# EasyEDA Pro project 光磁共振实验仪.eprj, board FD-OPMR-A2
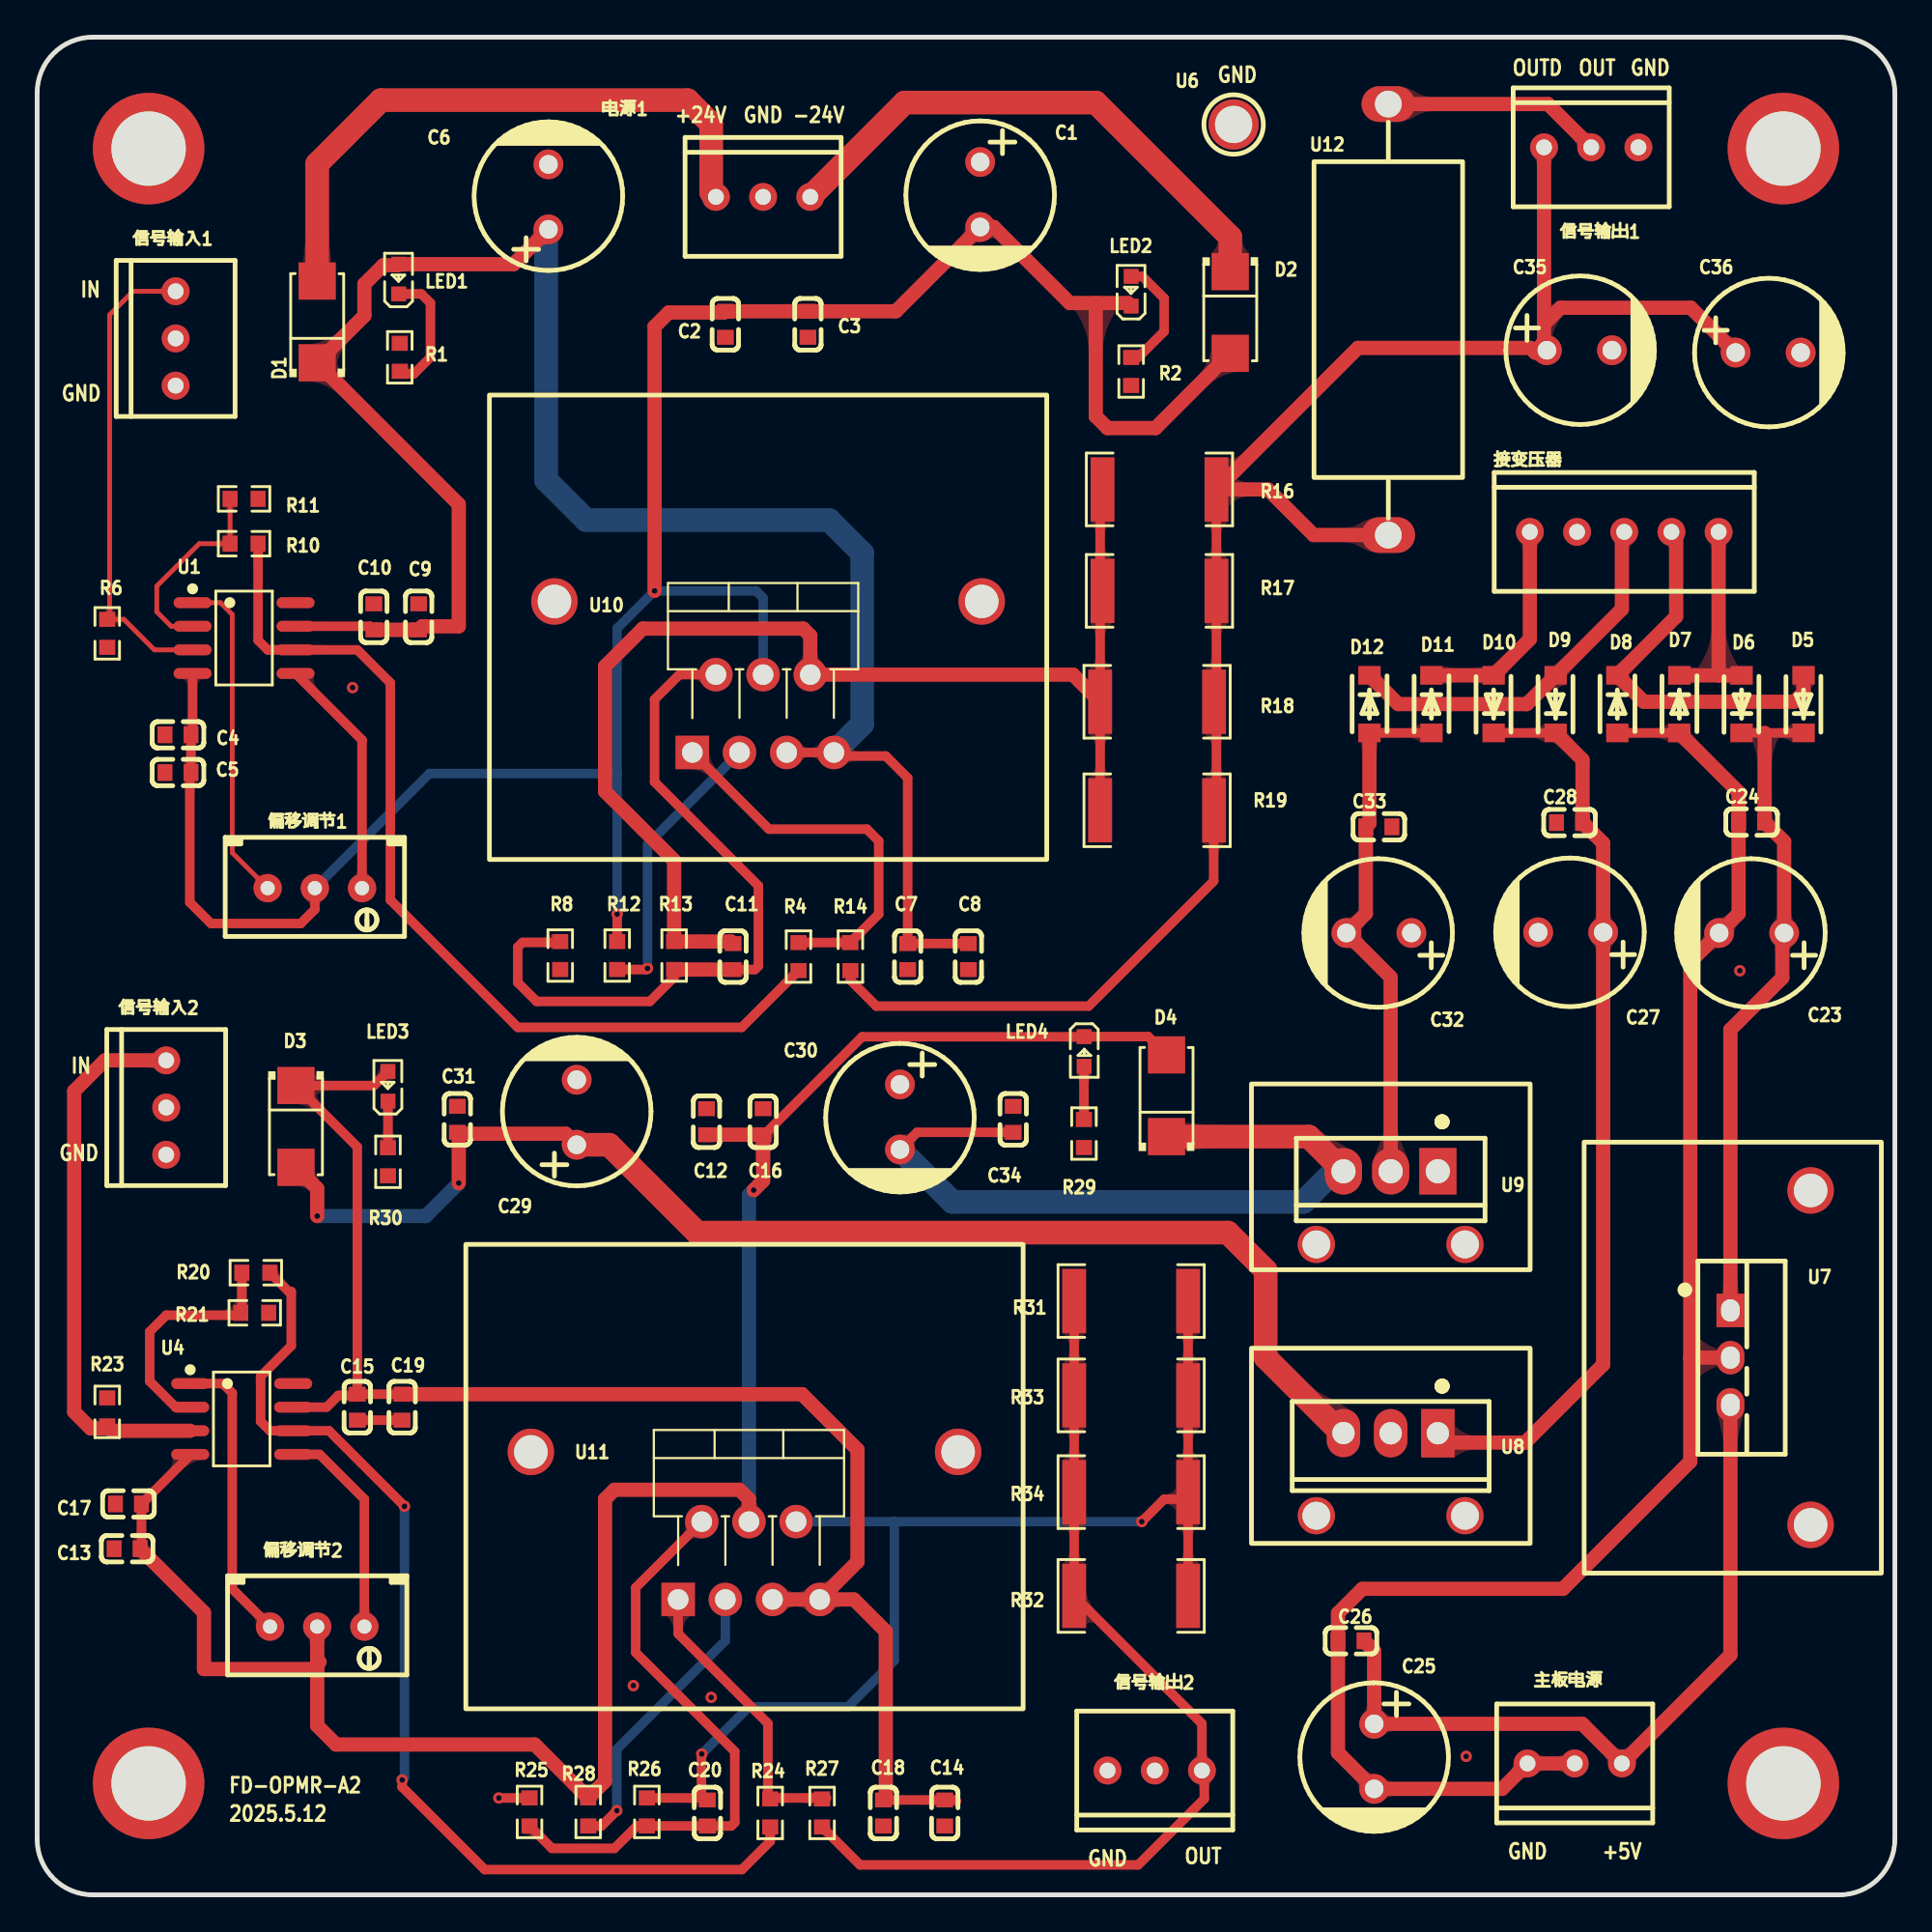
[diagram p11: board, top side]
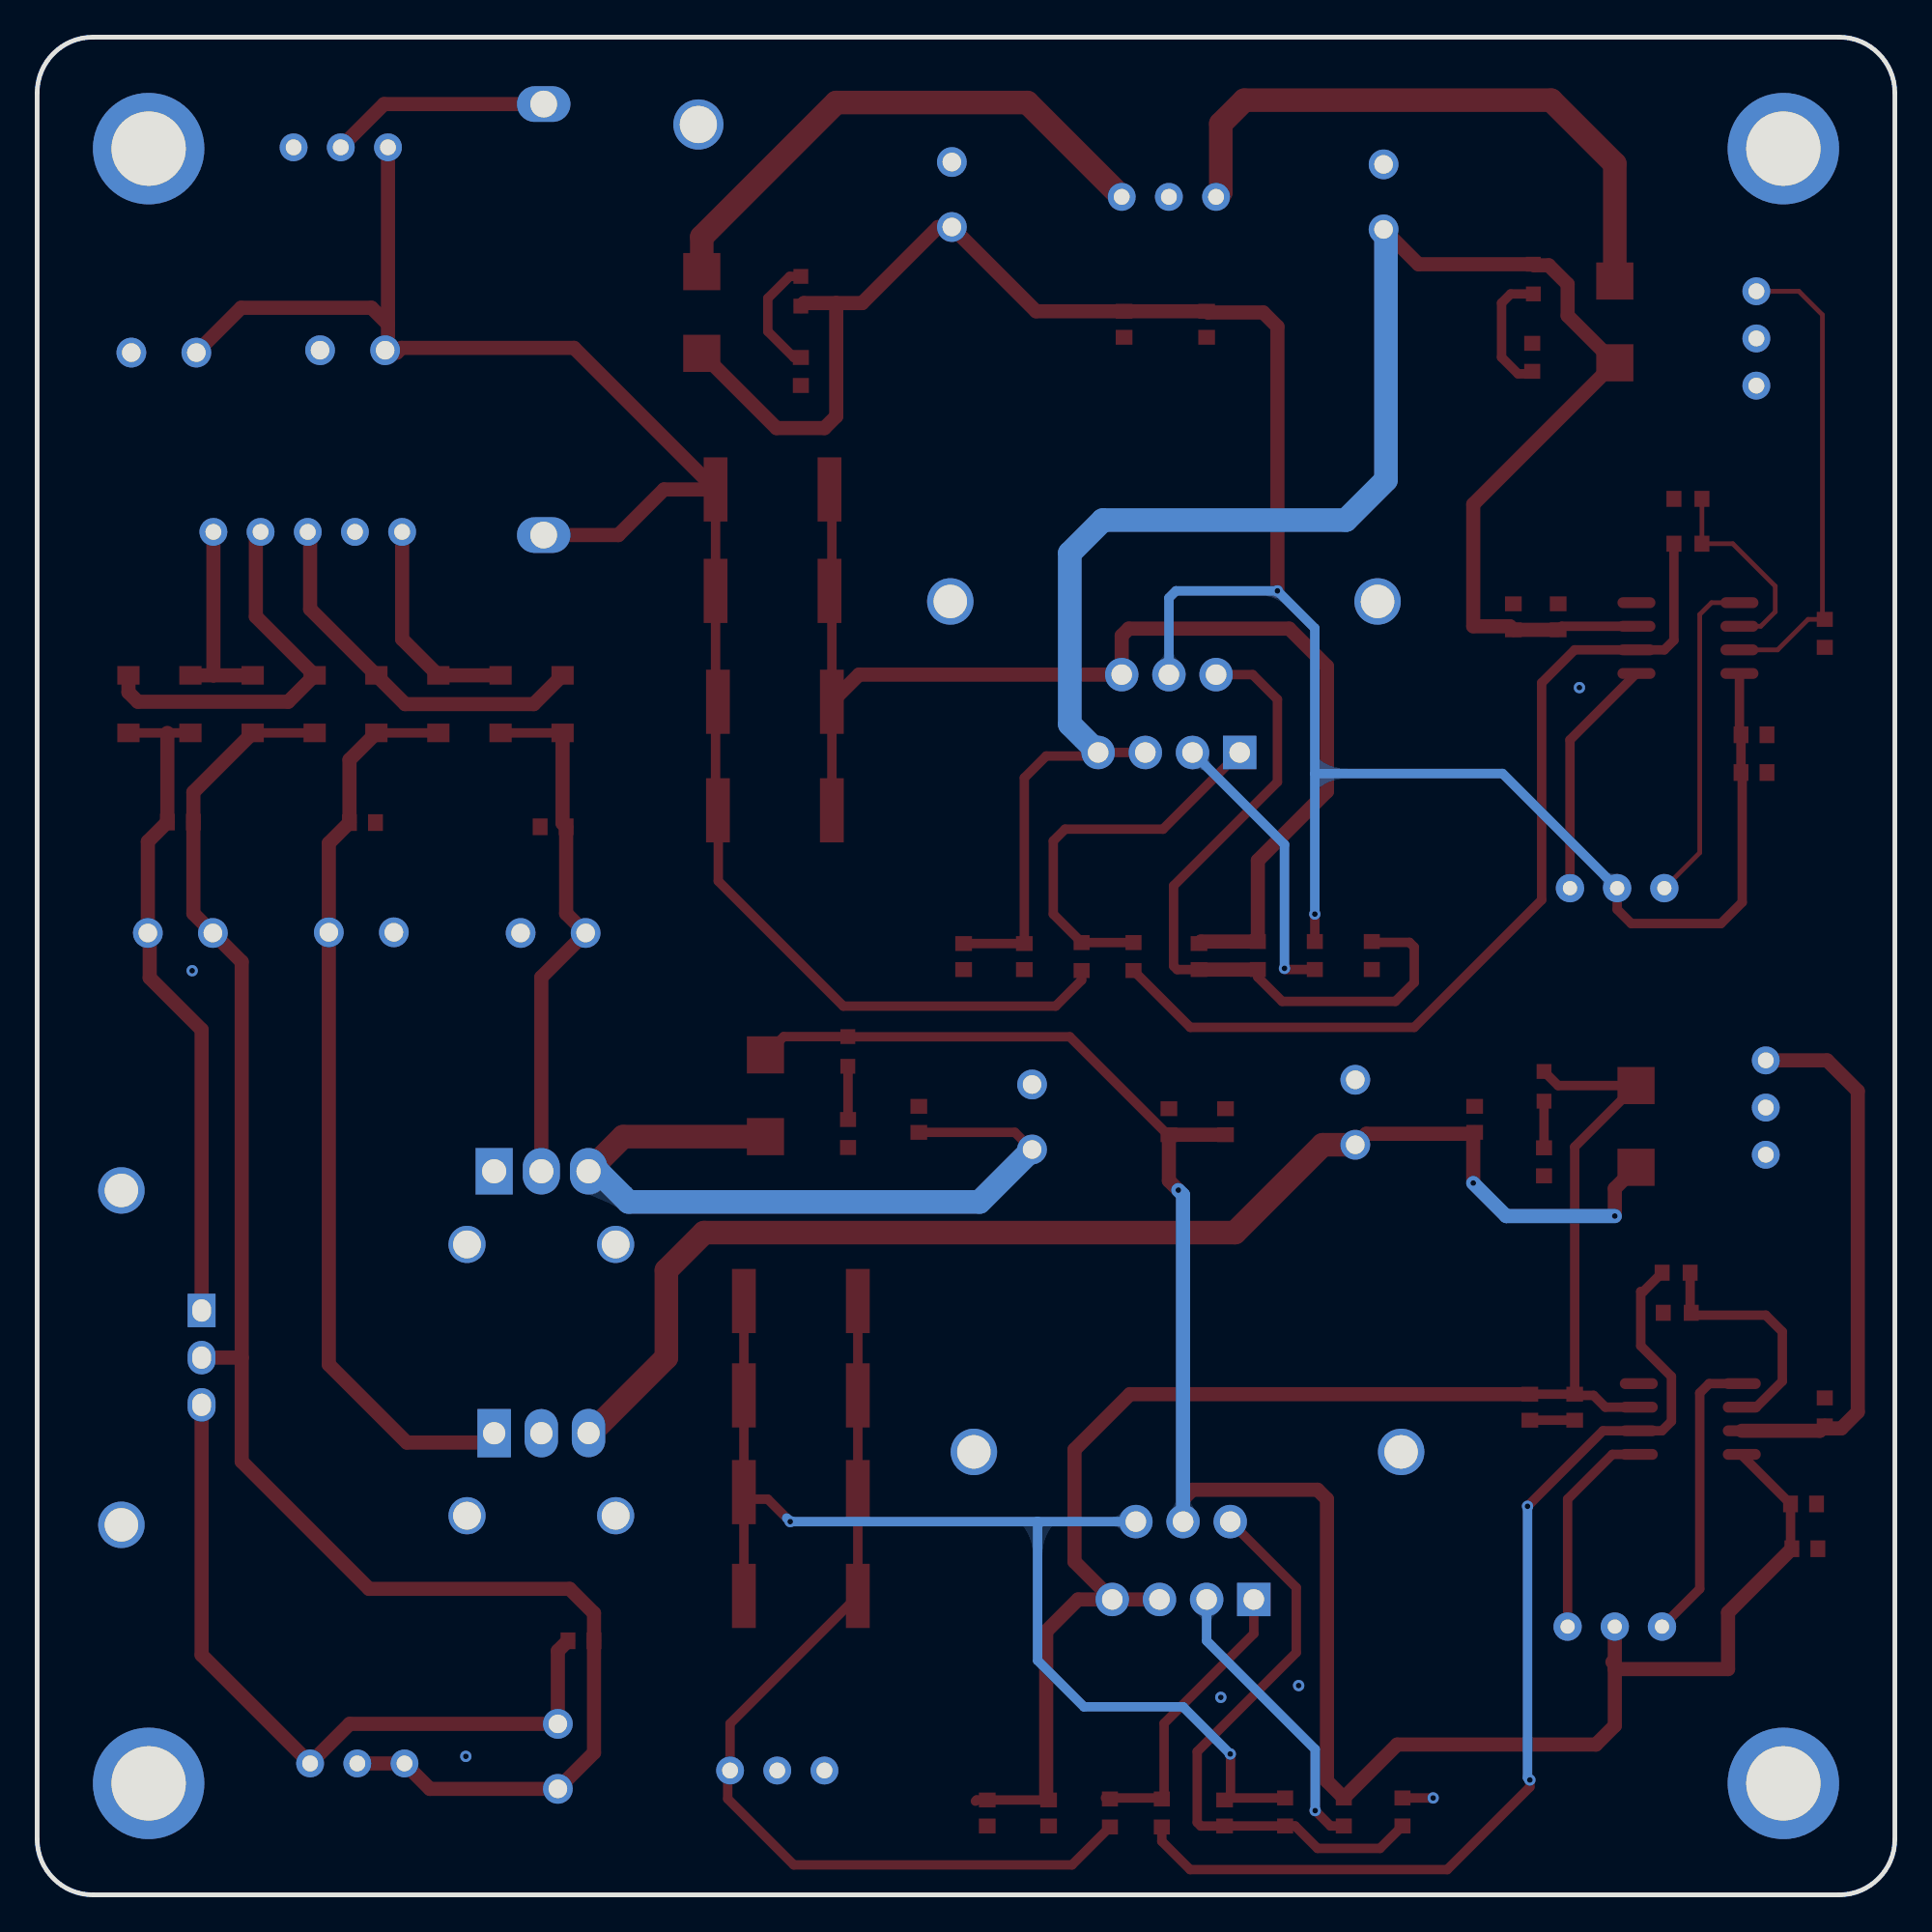
[diagram p12: board, bottom side, seen from below]

Outline 100 x 100 mm; copper layers: Top Layer, Bottom Layer. Coordinates in mm from the lower left corner of the outline.
Outline path: 0,97 0,3 arc(0.88,0.88) 3,0 97,0 arc(99.12,0.88) 100,3 100,97 arc(99.12,99.12) 97,100 3,100 arc(0.88,99.12) 0,97
Stack: Top Layer 0.035mm / Dielectric1 1.51mm FR4 er 4.5 / Bottom Layer 0.035mm

## Design rules (mm)
template: 自定义配置
spacing copperThickness1oz (default): track to track 0.102, other pairs 0.152 to 0.3
spacing copperThickness2oz: track to track 0.203, other pairs 0.152 to 0.3
track width copperThickness1oz (default): min 0.127, default 0.254, max 2.54
track width copperThickness2oz: min 0.203, default 0.254, max 2.54
differential pair differentialPair (default): width min 0.127, default 0.254, max 2.54; gap min 0.152, default 0.152
via viaSize (default): diameter min 0.5, default 0.61, max 10; hole min 0.3, default 0.305, max 6.3

## Placement (name value [footprint] x y rotation side)
C1  470uF  [cap-th_bd8.0-p3.50-d0.6-fd_1]  50.76 91.53 270 top
C2  100nF  [C0603]  37.05 84.54 90 top
C3  10uF  [C0603]  41.49 84.54 90 top
C4  100nF  [C0603]  7.58 62.45 0 top
C5  10uF  [C0603]  7.58 60.41 0 top
C6  470uF  [cap-th_bd8.0-p3.50-d0.6-fd_1]  27.52 91.4 90 top
C7  100nF  [C0603]  46.86 50.51 270 top
C8  10uF  [C0603]  50.13 50.51 270 top
C9  100nF  [C0603]  20.54 68.8 90 top
C10  10uF  [C0603]  18.12 68.8 90 top
C11  5pF  [C0603]  37.46 50.51 90 top
C12  100nF  [C0603]  36.03 41.62 270 top
C13  100nF  [C0603]  4.84 18.63 0 top
C14  100nF  [C0603]  48.86 4.41 270 top
C15  100nF  [C0603]  17.23 26.25 270 top
C16  10uF  [C0603]  39.08 41.62 270 top
C17  10uF  [C0603]  4.92 21.04 0 top
C18  10uF  [C0603]  45.56 4.41 270 top
C19  10uF  [C0603]  19.65 26.25 270 top
C20  5pF  [C0603]  36.08 4.41 90 top
C23  470uF  [cap-th_bd8.0-p3.50-d0.6-fd_1]  92.29 51.78 180 top
C24  100nF  [C0603]  92.29 57.75 0 top
C25  470uF  [cap-th_bd8.0-p3.50-d0.6-fd_1]  71.97 7.46 270 top
C26  100nF  [C0603]  70.72 13.68 0 top
C27  470uF  [cap-th_bd8.0-p3.50-d0.6-fd_1]  82.55 51.81 180 top
C28  100nF  [C0603]  82.49 57.72 0 top
C29  470uF  [cap-th_bd8.0-p3.50-d0.6-fd_1]  29.04 42.13 90 top
C30  470uF  [cap-th_bd8.0-p3.50-d0.6-fd_1]  46.44 41.87 270 top
C31  100nF  [C0603]  22.62 41.75 270 top
C32  470uF  [cap-th_bd8.0-p3.50-d0.6-fd_1]  72.22 51.78 180 top
C33  100nF  [C0603]  72.22 57.49 0 top
C34  100nF  [C0603]  52.54 41.75 90 top
C35  NC  [CAP-TH_BD8.0-P3.50-D0.6-FD_1]  83.02 83.15 0 top
C36  NC  [CAP-TH_BD8.0-P3.50-D0.6-FD_1]  93.18 83.02 0 top
D1  SS34  [SMA_L4.3-W2.6-LS5.2-RD]  15.08 84.67 90 top
D2  SS34  [SMA_L4.3-W2.6-LS5.2-RD]  64.22 85.18 270 top
D3  SS34  [SMA_L4.3-W2.6-LS5.2-RD]  13.93 41.36 270 top
D4  SS34  [SMA_L4.3-W2.6-LS5.2-RD]  60.79 43.02 90 top
D5  SM4007PL  [SOD-123F_L2.8-W1.8-LS3.7-RD]  95.09 64.1 90 top
D6  SM4007PL  [SOD-123F_L2.8-W1.8-LS3.7-RD]  91.75 64.1 90 top
D7  SM4007PL  [SOD-123F_L2.8-W1.8-LS3.7-RD]  88.4 64.1 270 top
D8  SM4007PL  [SOD-123F_L2.8-W1.8-LS3.7-RD]  85.06 64.1 270 top
D9  SM4007PL  [SOD-123F_L2.8-W1.8-LS3.7-RD]  81.74 64.1 90 top
D10  SM4007PL  [SOD-123F_L2.8-W1.8-LS3.7-RD]  78.4 64.1 90 top
D11  SM4007PL  [SOD-123F_L2.8-W1.8-LS3.7-RD]  75.05 64.1 270 top
D12  SM4007PL  [SOD-123F_L2.8-W1.8-LS3.7-RD]  71.72 64.1 270 top
LED1  KT-0603R  [LED0603-RD]  19.46 86.98 90 top
LED2  KT-0603R  [LED0603-RD]  58.89 86.32 90 top
LED3  KT-0603R  [LED0603-RD]  18.89 43.52 90 top
LED4  KT-0603R  [LED0603-RD]  56.36 45.4 270 top
NOREF  -  [Pad_e544]  76.86 35.01 0 top
NOREF#2  -  [Pad_e542]  68.86 35.01 0 top
NOREF#3  -  [Pad_e44671]  6 94 0 top
NOREF#4  -  [Pad_e44673]  6 6 0 top
NOREF#5  -  [Pad_e554]  76.86 20.41 0 top
NOREF#6  -  [Pad_e550]  95.47 19.92 0 top
NOREF#7  -  [Pad_e537]  50.85 69.62 0 top
NOREF#8  -  [Pad_e44672]  94 94 0 top
NOREF#9  -  [Pad_e549]  95.47 37.92 0 top
NOREF#10  -  [Pad_e44674]  94 6 0 top
NOREF#11  -  [Pad_e552]  49.58 23.84 0 top
NOREF#12  -  [Pad_e536]  27.85 69.62 0 top
NOREF#13  -  [Pad_e551]  26.58 23.84 0 top
NOREF#14  -  [Pad_e553]  68.86 20.41 0 top
R1  5.1kΩ  [R0603]  19.52 82.77 270 top
R2  5.1kΩ  [R0603]  58.89 82 90 top
R4  100kΩ  [R0603]  40.98 50.51 90 top
R6  3.6MΩ  [R0603]  3.77 67.91 90 top
R8  100kΩ  [R0603]  28.16 50.56 90 top
R10  1kΩ  [R0603]  11.14 72.73 0 top
R11  NC  [R0603]  11.14 75.15 180 top
R12  12kΩ  [R0603]  31.22 50.56 90 top
R13  100kΩ  [R0603]  34.29 50.56 90 top
R14  100kΩ  [R0603]  43.78 50.51 270 top
R16  24Ω  [R2512]  60.41 75.65 0 top
R17  24Ω  [R2512]  60.41 70.19 0 top
R18  24Ω  [R2512]  60.29 64.22 0 top
R19  24Ω  [R2512]  60.29 58.38 0 top
R20  1kΩ  [R0603]  11.77 33.49 0 top
R21  NC  [R0603]  11.71 31.33 180 top
R23  3.6MΩ  [R0603]  3.77 26 270 top
R24  100kΩ  [R0603]  39.46 4.41 90 top
R25  100kΩ  [R0603]  26.5 4.46 270 top
R26  100kΩ  [R0603]  32.82 4.46 90 top
R27  100kΩ  [R0603]  42.25 4.41 270 top
R28  12kΩ  [R0603]  29.66 4.46 90 top
R29  5.1kΩ  [R0603]  56.35 40.98 90 top
R30  5.1kΩ  [R0603]  18.89 39.46 90 top
R31  24Ω  [R2512]  58.89 31.97 180 top
R32  24Ω  [R2512]  58.89 16.09 180 top
R33  24Ω  [R2512]  58.89 26.89 180 top
R34  24Ω  [R2512]  58.89 21.68 180 top
U1  OPA445AU/2K5  [SOIC-8_L4.9-W3.9-P1.27-LS6.0-BL]  11.14 67.65 270 top
U4  OPA445AU/2K5  [SOIC-8_L4.9-W3.9-P1.27-LS6.0-BL]  11.01 25.62 270 top
U6  TP-黄色测试点  [TESTPOINT-TH_BD3.2]  64.41 95.3 90 top
U7  7805  [TO-220-3_L10.2-W4.5-P2.54-L-1]  91.15 28.92 270 top
U8  7812  [TO-220-3_L10.0-W4.5-P2.54-L]  72.86 24.85 180 top
U9  L7912ACV  [TO-220-3_L10.0-W4.5-P2.54-T]  72.86 38.95 270 top
U10  OPA547T  [TO-220-7-L10.5-W4.5-P1.27-BL]  39.08 63.59 0 top
U11  OPA547T  [TO-220-7-L10.5-W4.5-P1.27-BL]  38.32 18 0 top
U12  NC  [绕线电阻2W]  72.73 84.8 90 top
主板电源  -  [CH2.54-3插座]  82.77 7.07 180 top
信号输入1  -  [CH2.54-3插座]  7.45 83.78 90 top
信号输入2  -  [CH2.54-3插座]  6.95 42.38 90 top
信号输出1  -  [CH2.54-3插座]  83.66 94.07 0 top
信号输出2  -  [CH2.54-3插座]  60.16 6.69 180 top
偏移调节1  1KΩ  [RES-ADJ-TH_3296W]  14.95 54.19 270 top
偏移调节2  1KΩ  [RES-ADJ-TH_3296W]  15.08 14.44 270 top
接变压器  -  [CH2.54-5插座]  85.43 73.37 0 top
电源1  -  [CH2.54-3插座]  39.08 91.4 0 top

## Footprints (pads in the part's own frame, mm; a bottom-side part is the same pattern mirrored in y, then rotated)
C0603
  rect 0.8x0.9 smd: 1(-0.7,0) 2(0.7,0)
cap-th_bd8.0-p3.50-d0.6-fd_1
  round 1.6 hole 1: 1(-1.75,0) 2(1.75,0)
CAP-TH_BD8.0-P3.50-D0.6-FD_1
  round 1.6 hole 1: 1(-1.75,0) 2(1.75,0)
CH2.54-3插座
  round 1.5 hole 0.85: 1(-2.54,0) 2(0,0) 3(2.54,0)
CH2.54-5插座
  round 1.5 hole 0.85: 1(-5.08,0) 2(-2.54,0) 3(0,0) 4(2.54,0) 5(5.08,0)
LED0603-RD
  rect 0.8x0.8 smd: 1(-0.799,0) 2(0.799,0)
Pad_e536
  round 2.5 hole 1.8: 1(0,0)
Pad_e537
  round 2.5 hole 1.8: 2(0,0)
Pad_e542
  round 2 hole 1.5: 9(0,0)
Pad_e544
  round 2 hole 1.5: 9(0,0)
Pad_e549
  round 2.5 hole 1.8: 9(0,0)
Pad_e550
  round 2.5 hole 1.8: 9(0,0)
Pad_e551
  round 2.5 hole 1.8: 1(0,0)
Pad_e552
  round 2.5 hole 1.8: 2(0,0)
Pad_e553
  round 2 hole 1.5: 9(0,0)
Pad_e554
  round 2 hole 1.5: 9(0,0)
Pad_e44671
  round 6 hole 4: 1(0,0)
Pad_e44672
  round 6 hole 4: 1(0,0)
Pad_e44673
  round 6 hole 4: 1(0,0)
Pad_e44674
  round 6 hole 4: 1(0,0)
R0603
  rect 0.806x0.864 smd: 1(-0.753,0) 2(0.753,0)
R2512
  rect 1.282x3.456 smd: 1(-3.067,0) 2(3.067,0)
RES-ADJ-TH_3296W
  round 1.524 hole 0.762: 1(0,2.54) 2(0,0) 3(0,-2.54)
SMA_L4.3-W2.6-LS5.2-RD
  rect 2x2 smd: 1(-2.2,0) 2(2.2,0)
SOD-123F_L2.8-W1.8-LS3.7-RD
  rect 1x1.2 smd: 1(-1.55,0) 2(1.55,0)
SOIC-8_L4.9-W3.9-P1.27-LS6.0-BL
  oval 0.588x2.045 smd: 1(-1.905,-2.772) 2(-0.635,-2.772) 3(0.635,-2.772) 4(1.905,-2.772) 5(1.905,2.772) 6(0.635,2.772) 7(-0.635,2.772) 8(-1.905,2.772)
TESTPOINT-TH_BD3.2
  round 2.7 hole 2: 1(0,0)
TO-220-3_L10.0-W4.5-P2.54-L
  rect 1.8x2.6 hole 1.2: 1(-2.54,0.005)
  oval 1.8x2.6 hole 1.2: 2(0,0.005) 3(2.54,-0.005)
TO-220-3_L10.0-W4.5-P2.54-T
  rect 2.5x2 hole 1.3: 1(0,2.54)
  oval 2.5x2 hole 1.3: 2(0,0) 3(0,-2.54)
TO-220-3_L10.2-W4.5-P2.54-L-1
  rect 1.8x1.5 hole 1.2x1: 1(-2.54,0)
  oval 1.8x1.5 hole 1.2x1: 2(0,0) 3(2.54,0)
TO-220-7-L10.5-W4.5-P1.27-BL
  rect 1.8x1.8 hole 1.105x1.1: 1(-3.81,-2.095)
  round 1.8 hole 1.105x1.1: 2(-2.54,2.095) 3(-1.27,-2.095) 4(0,2.095) 5(1.27,-2.095) 6(2.54,2.095) 7(3.81,-2.095)
绕线电阻2W
  oval 1.92x2.88 hole 1.44: 1(-11.6,0) 2(11.6,0)

## Nets
As in the schematic, except:
GND: C1.1 C2.1 C3.1 C4.1 C5.1 C6.2 C7.2 C8.2 C9.2 C10.2 C12.1 C13.1 C14.2 C15.2 C16.1 C17.1 C18.2 C19.2 C27.2 C28.1 C29.2 C30.1 C31.1 C32.1 C33.2 C34.2 C35.2 C36.2 NOREF#3.1 NOREF#4.1 NOREF#8.1 NOREF#10.1 R1.1 R2.1 R6.1 R8.1 R11.1 R21.1 R23.1 R25.1 R29.1 R30.1 U6.1 U8.2 U9.1 信号输入1.1 信号输入1.2 信号输入2.1 信号输入2.2 信号输出1.3 信号输出2.2 信号输出2.3 接变压器.2 电源1.2

Pads without a net: NOREF 9; NOREF#2 9; NOREF#5 9; NOREF#6 9; NOREF#7 2; NOREF#9 9; NOREF#11 2; NOREF#12 1; NOREF#13 1; NOREF#14 9; U1 8; U4 8

## Via types
v1: diameter 0.61, hole 0.305, Top Layer to Bottom Layer, 17 vias

## Routing (per net, layer and track width the routed paths; a pad name or vN(x,y) marks a point on that pad's centre or on a via; arc(x,y) is an arc through that point)
+12V: length 84
  Top Layer w0.508: 49.49,5.04 49.43,5.11 C14.1 C18.1 ; C15.1 C19.1 ; C15.1 17.23,40.26 D3.1 18.13,43.56 LED3.2 ; C15.1 17.17,26.89 16.22,26.89 15.58,26.25 U4.7
  Top Layer w0.762: U11.7 U11.5 ; U11.7 43.97,15.9 45.68,14.19 45.68,5.23 C18.1 ; U11.7 44.16,17.93 44.16,23.97 41.17,26.95 C19.1
+12V_IN: length 71.1
  Top Layer w0.762: 22.69,40.97 C31.2 ; 22.69,40.97 28.45,40.97 C29.1 ; 22.69,40.97 v1(22.69,38.32) ; D3.2 15.08,38.02 v1(15.08,36.54)
  Top Layer w1.27: 70.19,24.86 66.13,28.92 66.13,33.62 64.1,35.65 35.52,35.65 30.79,40.38 C29.1
  Bottom Layer w0.762: v1(15.08,36.54) 20.92,36.54 v1(22.69,38.32)
+24V: length 105.5
  Top Layer w0.508: U10.5 U10.7 43.08,61.3 45.68,61.3 46.86,60.13 C7.1 C8.1 ; C10.1 17.93,68.29 U1.7
  Top Layer w0.762: C10.1 C9.1 20.73,68.29 22.69,68.29 22.69,74.85 D1.1 17.61,85.01 17.61,86.7 18.63,87.72 19.4,87.72 LED1.2 25.65,87.78 C6.1
  Bottom Layer w1.27: U10.7 44.41,63.02 44.41,72.22 42.63,74 29.55,74 27.39,76.16 27.39,89.53 C6.1
+24V_IN: length 33.5
  Top Layer w1.27: D1.2 15.08,93.18 18.5,96.61 35.01,96.61 36.28,95.34 36.28,91.66 电源1.1
-12V: length 116.2
  Top Layer w0.508: U4.4 8.24,23.67 C17.2 5.61,18.7 C13.2 ; D4.2 59.81,46.2 LED4.1 56.35,46.19 44.41,46.19 39.14,40.92 C16.2
  Top Layer w0.762: 15.08,12.15 15.08,12.41 ; 15.08,12.15 15.08,9.11 16.09,8.09 26.79,8.09 R28.2 30.57,6.12 30.57,21.3 31.08,21.81 37.81,21.81 38.32,21.3 U11.4 ; 15.08,12.15 8.98,12.15 8.98,15.2 C13.2 ; 15.08,12.41 偏移调节2.2 ; 15.08,12.41 15.2,12.53 ; v1(38.57,37.94) 39.08,38.44 C16.2 C12.2
  Bottom Layer w0.762: v1(38.57,37.94) 38.32,37.68 U11.4
-12V_IN: length 42.5
  Top Layer w0.508: C34.1 47.37,41.05 C30.2
  Top Layer w1.27: U9.3 68.46,40.81 D4.1
  Bottom Layer w1.27: C30.2 49.27,37.3 68.16,37.3 69.81,38.95 U9.3
-24V: length 128.8
  Top Layer w0.508: U1.4 8.37,62.53 C4.2 C5.2 8.22,60.35 8.22,53.43 9.36,52.29 14.19,52.29 14.95,53.05 偏移调节1.2 ; R12.2 v1(31.22,52.79)
  Top Layer w0.762: 56.99,85.69 56.99,79.59 57.62,78.96 60.2,78.96 D2.2 ; 56.99,85.69 58.73,85.69 LED2.1 ; 56.99,85.69 55.59,85.69 51.5,89.78 C1.2 46.23,85.24 C3.2 C2.2 36.98,85.18 34,85.18 33.24,84.42 v1(33.24,70.19)
  Bottom Layer w0.508: U10.4 39.08,69.81 38.7,70.19 v1(33.24,70.19) 31.22,68.18 31.22,60.36 ; 偏移调节1.2 21.12,60.36 31.22,60.36 ; 31.22,60.36 v1(31.22,52.79)
-24V_IN: length 29.6
  Top Layer w1.27: 电源1.3 46.7,96.48 56.99,96.48 64.22,89.24 D2.1
GND: length 4.1
  Top Layer w0.508: R25.1 v1(24.85,5.22) ; C15.2 C19.2
  vias: v1(16.98,64.99) v1(32.09,11.26) v1(36.28,10.63) v1(76.92,7.46) v1(91.66,49.75)
$1N1627: length 10.9
  Top Layer w0.254: U1.2 7.22,68.29 6.44,69.06 6.44,70.45 8.72,72.73 R10.1 R11.2
$1N1629: length 17.9
  Top Layer w0.254: 偏移调节1.3 10.5,56.1 10.5,68.92 9.87,69.56 U1.1
$1N1630: length 13
  Top Layer w0.508: U1.5 17.49,62.17 偏移调节1.1
$1N1634: length 51
  Top Layer w0.508: R4.1 37.93,46.7 25.87,46.7 19.01,53.56 19.01,65.24 17.23,67.02 U1.6 12.41,67.02 11.89,67.53 R10.2
$1N1636: length 39.2
  Top Layer w0.508: U10.2 34.57,65.68 33.24,64.35 33.24,59.91 38.82,54.32 38.82,50 38.63,49.81 C11.1 ; R8.2 28.11,51.27 26.12,51.27 25.87,51.02 25.87,49.11 26.89,48.09 32.98,48.09 34.29,49.41 34.29,49.81
  Top Layer w0.762: R13.1 34.29,49.81 C11.1
$1N1637: length 67.2
  Top Layer w0.508: R19.1 R18.1 57.22,75.53 R16.1
  Top Layer w0.762: C11.2 37.35,51.32 R13.2 34.29,55.68 30.57,59.4 30.57,66.13 32.6,68.16 41.24,68.16 41.62,67.78 U10.6 55.76,65.68 R18.1
$1N1639: length 21
  Top Layer w0.508: 43.69,51.26 R14.1 ; 43.69,51.26 R4.2 ; 43.69,51.26 43.82,51.32 45.3,52.79 45.3,56.73 44.67,57.37 39.4,57.37 U10.1
$1N1642: length 15.3
  Top Layer w0.508: R12.1 32.79,49.81 v1(32.85,49.87)
  Bottom Layer w0.508: U10.3 32.85,56.54 v1(32.85,49.87)
$1N1654: length 25.8
  Top Layer w0.254: 信号输入1.3 5.17,86.32 3.9,85.05 3.9,68.79 R6.2 4.67,68.66 6.31,67.02 U1.3
$1N1655: length 6.9
  Top Layer w0.508: LED1.1 20.68,86.18 21.17,85.69 21.17,82.77 20.28,81.88 19.66,81.88 R1.2
$1N1656: length 6.4
  Top Layer w0.508: R2.2 59.26,82.76 60.67,84.16 60.67,85.94 59.49,87.12 LED2.2
$1N4036: length 11.9
  Top Layer w0.762: 信号输出1.2 81.33,96.4 U12.2
$1N4041: length 98.2
  Top Layer w0.508: R16.2 R17.2 63.48,58.51 R19.2 63.34,58.36 63.34,54.57 56.6,47.84 45.17,47.84 43.78,49.24 R14.2
  Top Layer w0.762: 81.12,84.55 81.12,83.5 80.63,83.02 80.38,83.27 71.1,83.27 R16.2 66.26,75.65 68.71,73.2 U12.1 ; 81.12,84.55 信号输出1.1 ; 81.12,84.55 82,85.43 89.02,85.43 C36.1
$2N1627: length 12.9
  Top Layer w0.508: U4.2 7.45,26.25 6.06,27.65 6.06,30.31 6.95,31.2 10.83,31.2 R21.2 11.02,31.39 R20.1
$2N1629: length 15.9
  Top Layer w0.508: 8.24,27.52 10,27.52 10.5,27.01 10.5,16.47 偏移调节2.3
$2N1630: length 11.7
  Top Layer w0.508: 偏移调节2.1 17.61,21.3 15.2,23.71 U4.5
$2N1634: length 57.1
  Top Layer w0.508: R20.2 13.54,32.47 13.68,32.47 13.68,29.55 12.03,27.9 12.03,25.49 12.53,24.98 15.71,24.98 v1(19.77,20.92) ; v1(19.65,6.19) 19.65,5.8 24.09,1.36 37.94,1.36 39.46,2.88 R24.1
  Bottom Layer w0.508: v1(19.77,20.92) 19.77,6.31 v1(19.65,6.19)
$2N1636: length 32
  Top Layer w0.508: 26.5,3.71 27.71,2.5 31.08,2.5 32.28,3.71 36.08,3.71 C20.1 37.36,3.71 37.55,3.9 37.55,7.71 32.22,13.04 32.22,16.54 U11.2
$2N1637: length 63.5
  Top Layer w0.508: 35.76,5.22 35.76,7.57 v1(35.78,7.58) ; 35.76,5.22 35.97,5.22 C20.2 ; 35.76,5.22 R26.2 ; v1(59.46,20.09) 60.67,21.3 61.58,21.3 R34.1 ; R34.1 R33.1 R31.1 ; R34.1 R32.1
  Bottom Layer w0.508: 59.65,20.28 v1(59.46,20.09) 46.15,20.09 ; 46.15,20.09 46.15,12.62 43.65,10.12 38.32,10.12 v1(35.78,7.58) ; 46.15,20.09 U11.6
$2N1639: length 15.8
  Top Layer w0.508: 42.49,5.22 39.34,5.22 39.34,9.23 34.51,14.06 U11.1
$2N1642: length 15.7
  Top Layer w0.508: v1(31.2,4.53) 30.38,3.71 29.66,3.71
  Bottom Layer w0.508: U11.3 37.05,13.68 31.2,7.84 v1(31.2,4.53)
$2N1645: length 52.6
  Top Layer w0.508: R31.2 R33.2 R34.2 R32.2 62.7,9.21 信号输出2.1 62.83,6.57 62.83,5.17 59.27,1.61 44.29,1.61 R27.2
$2N1654: length 29.7
  Top Layer w0.762: 8.24,24.98 4.03,24.98 R23.2 3.64,25.11 2.88,25.11 1.99,26 1.99,43.27 3.64,44.92 信号输入2.3
$2N1655: length 2.5
  Top Layer w0.508: LED3.1 R30.2
$2N1656: length 2.9
  Top Layer w0.508: LED4.2 56.35,44.59 R29.2
$3N669: length 36.1
  Top Layer w0.508: D6.1 D5.1
  Top Layer w0.762: 92.99,62.55 C24.2 94.04,56.7 C23.1 93.94,51.68 93.94,49.36 91.15,46.57 U7.1
$3N1351: length 49.2
  Top Layer w0.508: D10.1 D9.1
  Top Layer w0.762: D9.1 83.19,61.1 C28.2 84.3,56.61 C27.1 84.3,28.55 80.1,24.35 75.9,24.35 75.4,24.85
$3N1949: length 28.4
  Top Layer w0.508: D12.2 D11.2
  Top Layer w0.762: D12.2 71.72,57.69 C33.1 71.53,52.83 C32.2 72.86,49.39 U9.2
$3N2089: length 40.6
  Top Layer w0.762: U7.3 91.15,12.92 主板电源.1 83.18,9.21 C25.1 71.97,13.13 C26.2
$3N2139: length 91.1
  Top Layer w0.508: D8.2 D7.2
  Top Layer w0.762: D7.2 91.59,59.36 C24.1 91.59,52.83 C23.2 88.99,50.23 88.99,28.92 ; 88.99,28.92 88.99,23.33 82.13,16.47 71.34,16.47 70.03,15.16 C26.1 70.03,7.65 C25.2 78.86,5.71 主板电源.3 主板电源.2 ; 88.99,28.92 U7.2
$3N2809: length 11.1
  Top Layer w0.762: 接变压器.5 90.51,65.65 90.51,65.65 ; 90.51,65.65 88.4,65.65 ; 90.51,65.65 91.75,65.65
$3N2828: length 20.9
  Top Layer w0.762: 95.09,65.65 95.09,64.73 94.58,64.22 86.49,64.22 85.06,65.65 88.23,68.81 88.23,73.11 接变压器.4
$3N2854: length 11.9
  Top Layer w0.762: 接变压器.1 80.35,67.6 78.4,65.65 75.05,65.65
$3N2892: length 20.6
  Top Layer w0.762: 接变压器.3 85.31,73.24 85.31,69.21 80.19,64.1 73.27,64.1 71.72,65.65

## Copper pours and planes (outline as drawn; the poured copper is in the pictures)
GND on Top Layer: -10.07,106.64 107.66,106.64 107.66,-7.02 -10.07,-7.02
GND on Bottom Layer: -11.21,106.64 106.9,106.64 106.9,-6.13 -11.21,-6.13

Small or netless copper shapes (teardrops, artwork), in the pictures only: 238 on Top Layer, 12 on Bottom Layer

## Text on the board
Top Silkscreen Layer: FD-OPMR-A2 | 2025.5.12 | GND | IN | +24V | -24V | OUT | OUTD | +5V
